# EasyEDA Pro project busmaster-v102.eprj, board main-board
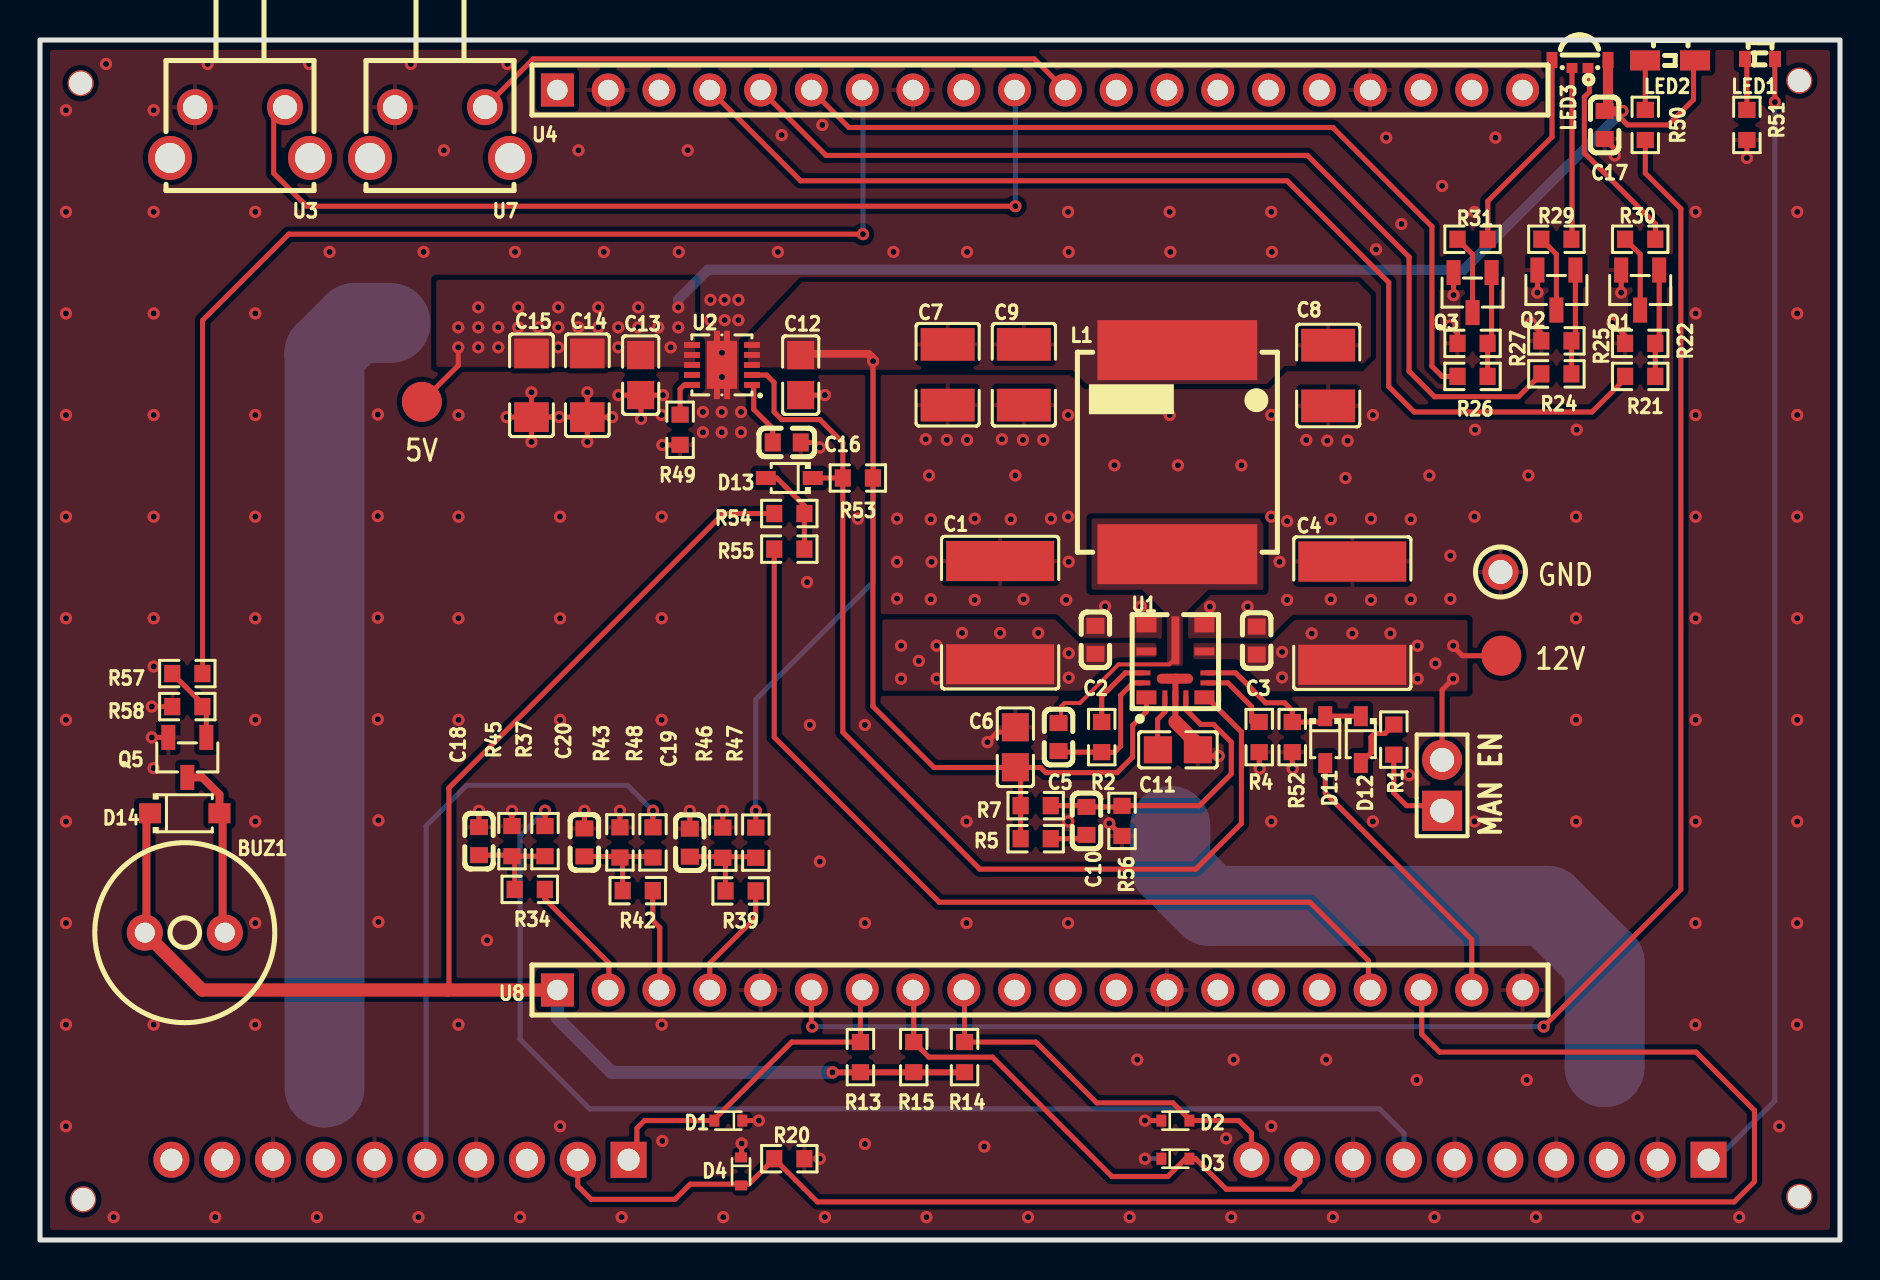
[diagram p7: board, top side]
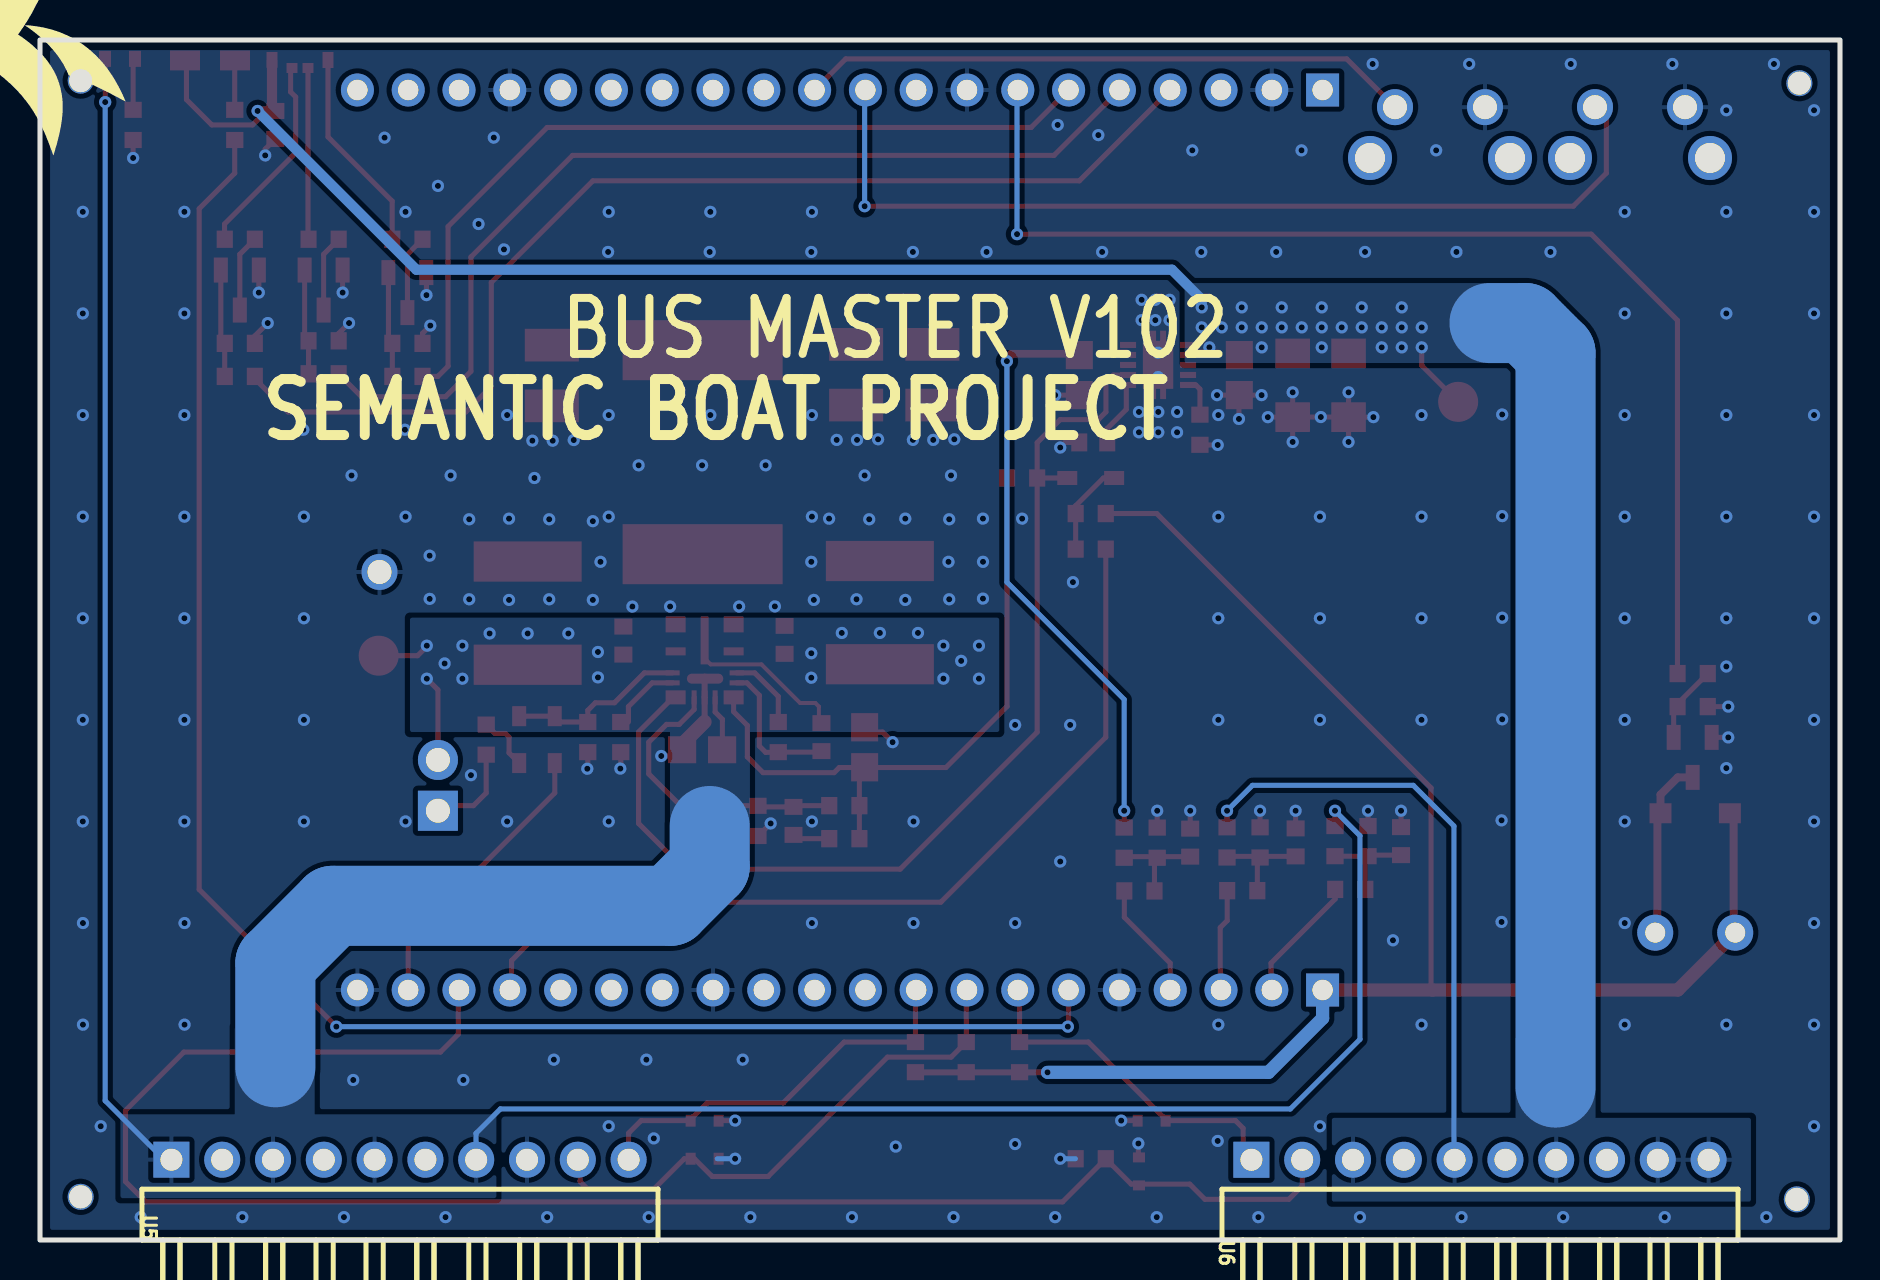
[diagram p8: board, bottom side, seen from below]

Outline 90 x 60 mm; copper layers: Top Layer, Inner1, Inner2, Bottom Layer. Coordinates in mm from the lower left corner of the outline.
Outline path: rectangle 0,60 90,0
Stack: Top Layer 0.035mm Outer layer thickness 1oz / Dielectric1 0.2104mm 7628 RC49% 8.6mil / Inner1 0.0152mm Inner layer thickness / Dielectric2 1.065mm 1.1mm H/HOZ Copper / Inner2 0.0152mm Inner layer thickness / Dielectric3 0.2104mm 7628 RC49% 8.6mil / Bottom Layer 0.035mm Outer layer thickness 1oz

## Design rules (mm)
template: Custom Config
spacing copperThickness1oz (default): track to track 0.102, other pairs 0.152 to 0.3
spacing copperThickness2oz: track to track 0.203, other pairs 0.152 to 0.3
track width copperThickness1oz (default): min 0.127, default 0.254, max 10
track width copperThickness2oz: min 0.203, default 0.254, max 2.54
differential pair differentialPair (default): width min 0.127, default 0.254, max 2.54; gap min 0.152, default 0.152
via viaSize (default): diameter min 0.5, default 0.61, max 10; hole min 0.3, default 0.305, max 6.3

## Placement (name value [footprint] x y rotation side)
BUZ1  2.7kHz  [BUZ-TH_BD9.0-P4.00-D0.6-FD]  7.24 15.37 0 top
C1  22uF  [C2220]  48.01 31.37 270 top
C2  100nF  [C0603]  52.77 30.01 270 top
C3  100nF  [C0603]  60.83 29.97 270 top
C4  22uF  [C2220]  65.62 31.34 270 top
C5  100nF  [C0603]  50.93 25.15 90 top
C6  1uF  [C0805]  48.77 24.64 90 top
C7  47uF  [C1210]  45.38 43.26 90 top
C8  47uF  [C1210]  64.41 43.22 90 top
C9  47uF  [C1210]  49.19 43.26 90 top
C10  22pF  [C0603]  52.32 20.95 90 top
C11  1uF  [C0805]  56.9 24.51 180 top
C12  1uF  [C0805]  38.03 43.24 270 top
C13  1uF  [C0805]  30.03 43.24 270 top
C14  22uF  [C1206]  27.37 42.74 90 top
C15  22uF  [C1206]  24.57 42.74 90 top
C16  3.3nF  [C0603]  37.34 39.88 180 top
C17  100nF  [C0603]  78.23 55.75 270 top
C18  100nF  [C0603]  21.95 19.94 270 top
C19  100nF  [C0603]  32.49 19.87 270 top
C20  100nF  [C0603]  27.22 19.88 270 top
D1  ESD5Z3.3T1G  [SOD-523_L1.2-W0.8-LS1.6-FD]  34.42 5.97 0 top
D2  ESD5Z3.3T1G  [SOD-523_L1.2-W0.8-LS1.6-FD]  56.77 5.97 180 top
D3  ESD5Z3.3T1G  [SOD-523_L1.2-W0.8-LS1.6-FD]  56.77 4.06 180 top
D4  ESD5Z3.3T1G  [SOD-523_L1.2-W0.8-LS1.6-FD]  35.05 3.43 90 top
D11  1N5819WS  [SOD-323_L1.8-W1.3-LS2.5-RD]  64.26 25.02 270 top
D12  1N5819WS  [SOD-323_L1.8-W1.3-LS2.5-RD]  66.04 25.02 270 top
D13  1N5819WS  [SOD-323_L1.8-W1.3-LS2.5-RD]  37.47 38.1 180 top
D14  1N4148W  [SOD-123F_L2.7-W1.6-LS3.8-RD]  7.24 21.34 0 top
H1  PZ254V-11-02P  [HDR-TH_2P-P2.54-V-M]  70.1 22.73 90 top
L1  4.7uH  [IND-SMD_L10.9-W10.0]  56.87 39.39 90 top
LED1  XL-1606UYC  [LED-SMD_L1.7-W1.1-RD_27-21]  86 59.06 0 top
LED2  LTST-S220TGKT  [LED-SMD_L2.2-W0.6-RD_GREEN]  81.5 58.98 0 top
LED3  MHS110RGBCT  [LED-ARRAY-SMD_MHS110RGBCT]  77 58.8 0 top
NOREF  -  [Pad_e59]  87.97 2.16 90 top
NOREF#2  -  [Pad_e58]  2.16 2.03 0 top
NOREF#3  -  [Pad_e61]  2.03 57.84 270 top
NOREF#4  -  [Pad_e60]  87.97 57.97 180 top
Q1  2N7002  [SOT-23-3_L2.9-W1.3-P1.90-LS2.4-BR]  80.01 47.5 90 top
Q2  2N7002  [SOT-23-3_L2.9-W1.3-P1.90-LS2.4-BR]  75.82 47.5 90 top
Q3  2N7002  [SOT-23-3_L2.9-W1.3-P1.90-LS2.4-BR]  71.63 47.37 90 top
Q5  AO3400A  [SOT-23-3_L2.9-W1.3-P1.90-LS2.4-BR]  7.37 24.13 90 top
R1  10kΩ  [R0603]  67.69 25.02 90 top
R2  0Ω  [R0603]  53.09 25.15 90 top
R4  33kΩ  [R0603]  60.96 25.15 90 top
R5  1kΩ  [R0603]  49.78 20.07 180 top
R7  100kΩ  [R0603]  49.78 21.72 180 top
R13  2.2kΩ  [R0603]  41.02 9.14 270 top
R14  2.2kΩ  [R0603]  46.23 9.14 270 top
R15  2.2kΩ  [R0603]  43.69 9.14 270 top
R20  47kΩ  [R0603]  37.47 4.06 180 top
R21  100Ω  [R0603]  80.01 43.18 180 top
R22  100kΩ  [R0603]  80.01 44.83 180 top
R24  100Ω  [R0603]  75.82 43.31 0 top
R25  100kΩ  [R0603]  75.82 44.96 180 top
R26  100Ω  [R0603]  71.63 43.18 0 top
R27  100kΩ  [R0603]  71.63 44.83 180 top
R29  100Ω  [R0603]  75.82 50.04 0 top
R30  100Ω  [R0603]  80.01 50.04 0 top
R31  120Ω  [R0603]  71.63 50.04 0 top
R34  1kΩ  [R0603]  24.49 17.53 0 top
R37  100kΩ  [R0603]  25.25 19.94 270 top
R39  1kΩ  [R0603]  35.03 17.45 0 top
R42  1kΩ  [R0603]  29.89 17.47 0 top
R43  47kΩ  [R0603]  29 19.88 270 top
R45  10kΩ  [R0603]  23.6 19.94 270 top
R46  47kΩ  [R0603]  34.14 19.87 270 top
R47  100kΩ  [R0603]  35.79 19.87 270 top
R48  100kΩ  [R0603]  30.65 19.88 270 top
R49  30kΩ  [R0603]  32 40.51 90 top
R50  4.7kΩ  [R0603]  80.26 55.75 90 top
R51  15kΩ  [R0603]  85.34 55.75 90 top
R52  100kΩ  [R0603]  62.61 25.15 90 top
R53  100kΩ  [R0603]  40.89 38.1 0 top
R54  47kΩ  [R0603]  37.47 36.32 180 top
R55  4.7kΩ  [R0603]  37.47 34.54 180 top
R56  24kΩ  [R0603]  54.1 20.95 90 top
R57  220Ω  [R0603]  7.37 28.32 180 top
R58  47kΩ  [R0603]  7.37 26.67 0 top
TP8  RH-5004  [TESTPOINT_TH_BD2.5-D1.2]  73.03 33.4 0 top
TP38  -  [Test-Point-0.5mm]  73.07 29.22 0 top
TP39  -  [Test-Point-0.5mm]  19.09 41.91 0 top
U1  LM61460AANRJRR  [VQFN-HR-14_L4.0-W3.5-P0.50-TL_TI_RJR-1]  56.77 28.96 90 top
U2  TCKE812NA,RF  [VSON-10_L3.0-W3.0-P0.50-TL-EP]  34.1 43.75 180 top
U3  TC-6615-9.0-160G  [KEY-TH_PTS645VXX83XLFS]  10 55.37 180 top
U4  KH-2.54FH-1X20P-H8.5  [HDR-TH_20P-P2.54-V-F-2]  50 57.5 0 top
U5  2541WR-10P  [HDR-TH_10P-P2.54-H-M-W10.4]  72 4.01 180 bottom
U6  2541WR-10P  [HDR-TH_10P-P2.54-H-M-W10.4]  18 4.01 180 bottom
U7  TC-6615-9.0-160G  [KEY-TH_PTS645VXX83XLFS]  20 55.37 180 top
U8  KH-2.54FH-1X20P-H8.5  [HDR-TH_20P-P2.54-V-F-2]  50 12.5 0 top

## Footprints (pads in the part's own frame, mm; a bottom-side part is the same pattern mirrored in y, then rotated)
BUZ-TH_BD9.0-P4.00-D0.6-FD
  round 1.8 hole 1: 1(-2,0) 2(2,0)
C0603
  rect 0.8x0.9 smd: 1(-0.7,0) 2(0.7,0)
C0805
  rect 1.41x1.35 smd: 1(-1,0) 2(1,0)
C1206
  rect 1.485x1.728 smd: 1(-1.593,0) 2(1.593,0)
C1210
  rect 1.635x2.7 smd: 1(-1.518,0) 2(1.518,0)
C2220
  rect 2.01x5.4 smd: 1(-2.58,0) 2(2.58,0)
HDR-TH_2P-P2.54-V-M
  rect 2x2 hole 1.2: 1(-1.27,0)
  round 2 hole 1.2: 2(1.27,0)
HDR-TH_10P-P2.54-H-M-W10.4
  rect 1.8x1.8 hole 1.1: 1(-11.43,0)
  round 1.8 hole 1.1: 2(-8.89,0) 3(-6.35,0) 4(-3.81,0) 5(-1.27,0) 6(1.27,0) 7(3.81,0) 8(6.35,0) 9(8.89,0) 10(11.43,0)
HDR-TH_20P-P2.54-V-F-2
  rect 1.65x1.65 hole 1.02: 1(-24.13,0)
  round 1.65 hole 1.02: 2(-21.59,0) 3(-19.05,0) 4(-16.51,0) 5(-13.97,0) 6(-11.43,0) 7(-8.89,0) 8(-6.35,0) 9(-3.81,0) 10(-1.27,0) 11(1.27,0) 12(3.81,0) 13(6.35,0) 14(8.89,0) 15(11.43,0) 16(13.97,0) 17(16.51,0) 18(19.05,0) 19(21.59,0) 20(24.13,0)
IND-SMD_L10.9-W10.0
  rect 3x8 smd: 1(-5.1,0) 2(5.1,0)
KEY-TH_PTS645VXX83XLFS
  round 1.8 hole 1.2: 1(-2.25,-1.27) 2(2.25,-1.27)
  round 2.2 hole 1.5: 3(-3.5,1.27) 4(3.5,1.27)
LED-ARRAY-SMD_MHS110RGBCT
  rect 0.55x0.5 smd: 1(0.4,-0.2) 4(-0.4,-0.2)
  rect 0.55x0.8 smd: 2(1.4,0.2) 3(-1.4,0.2)
LED-SMD_L1.7-W1.1-RD_27-21
  rect 0.6x0.8 smd: 1(-0.75,0) 2(0.75,0)
LED-SMD_L2.2-W0.6-RD_GREEN
  rect 1.5x1 smd: 1(-1.25,0) 2(1.25,0)
Pad_e58
  round 1.3 hole 1.152: 1(0,0)
Pad_e59
  round 1.3 hole 1.152: 1(0,0)
Pad_e60
  round 1.3 hole 1.152: 1(0,0)
Pad_e61
  round 1.3 hole 1.152: 1(0,0)
R0603
  rect 0.806x0.864 smd: 1(-0.753,0) 2(0.753,0)
SOD-123F_L2.7-W1.6-LS3.8-RD
  rect 1.1x1 smd: 1(-1.735,0) 2(1.735,0)
SOD-323_L1.8-W1.3-LS2.5-RD
  rect 1x0.7 smd: 1(-1.173,0) 2(1.173,0)
SOD-523_L1.2-W0.8-LS1.6-FD
  rect 0.5x0.6 smd: 1(-0.7,0) 2(0.7,0)
SOT-23-3_L2.9-W1.3-P1.90-LS2.4-BR
  rect 1.25x0.7 smd: 1(1,-0.95) 2(1,0.95) 3(-1,0)
Test-Point-0.5mm
  round 2 smd: 1(0,0)
TESTPOINT_TH_BD2.5-D1.2
  round 1.8 hole 1.2: 1(0,0)
VQFN-HR-14_L4.0-W3.5-P0.50-TL_TI_RJR-1
  rect 0.7x1 smd: 1(-1.825,1.45) 5(-1.825,-1.45)
  rect 0.7x0.25 smd: 2(-1.825,0.525) 4(-1.825,-0.525)
  rect 0.7x0.3 smd: 3(-1.825,0)
  rect 0.25x0.7 smd: 6(-1.1,-1.6) 7(-0.6,-1.6) 13(-0.6,1.6) 14(-1.1,1.6)
  rect 0.4x1 smd: 8(0.475,-1.45) 12(0.475,1.45)
  rect 0.8x1 smd: 9(1.825,-1.45) 11(1.825,1.45)
  rect 2.4x0.4 smd: 10(1.025,0)
VSON-10_L3.0-W3.0-P0.50-TL-EP
  rect 0.8x0.3 smd: 1(-1.5,1) 2(-1.5,0.5) 3(-1.5,0) 4(-1.5,-0.5) 5(-1.5,-1) 6(1.5,-1) 7(1.5,-0.5) 8(1.5,0) 9(1.5,0.5) 10(1.5,1)
  custom 1.52x3.42 smd: 11(0.002,-0.009)

## Nets
As in the schematic.

Pads without a net: NOREF 1; NOREF#2 1; NOREF#3 1; NOREF#4 1; U2 9; U3 3 4; U4 1 3 9 12 13 14 15 16 18 19 20; U7 3 4; U8 10 11 12 14 15 16

## Via types
v1: diameter 0.61, hole 0.305, Top Layer to Bottom Layer, 306 vias

## Routing (per net, layer and track width the routed paths; a pad name or vN(x,y) marks a point on that pad's centre or on a via; arc(x,y) is an arc through that point)
5V0_GOOD: length 53.7
  Top Layer w0.254: 35.58,43.23 35.6,43.25 36.33,43.25 36.7,42.88 36.7,41.4 37.08,41.02 38.99,41.02 40.14,39.87 R53.1 ; U1.5 58.34,27.13 60.07,25.4 60.07,20.83 57.78,18.54 46.99,18.54 40.14,25.39 R53.1 ; R53.1 D13.1
5V_UNFUSED: length 72.5
  Top Layer w0.254: 41.65,43.95 R53.2 41.65,26.68 44.7,23.62 48.75,23.62 C6.1 48.78,23.62 ; 41.65,43.95 41.35,44.24 C12.1 38.17,44.38 41.47,44.38 41.65,44.2 41.65,43.95 ; 41.65,43.95 v1(41.66,43.94) ; U1.1 55.32,26.42 54.63,25.73 54.63,24.15 53.85,23.37 50.29,23.37 50.04,23.62 48.78,23.62 ; 48.78,23.62 49.03,23.38 R7.2 R5.2 ; R47.1 v1(35.79,21.46)
  Bottom Layer w0.254: v1(35.79,21.46) 35.79,27.03 41.66,32.89 41.66,44.07
+3V3: length 83
  Top Layer w0.254: 5.5,15.63 BUZ1.1 ; R54.2 34.16,36.32 20.45,22.61 20.45,12.57 20.37,12.5
  Top Layer w0.305: R14.2 46.22,8.38 v1(39.62,8.38)
  Top Layer w0.4: 5.5,15.63 5.32,15.82 5.32,21.15 D14.1
  Top Layer w0.66: BUZ1.1 8.11,12.5 U8.1
  Bottom Layer w0.66: v1(39.62,8.38) 28.57,8.38 25.87,11.09 U8.1
+5V: length 136.2
  Top Layer w0.254: 30.65,20.63 v1(30.65,21.46) ; 78.68,56.45 79.38,55.75 81.41,55.75 82.68,57.02 82.68,58.91 LED2.2 ; TP39.1 20.91,43.73 v1(20.91,44.63)
  Top Layer w0.457: C17.1 v1(79.12,56.45)
  Top Layer w0.508: C17.1 78.4,56.62 LED3.2
  Bottom Layer w0.254: U6.5 19.3,4.05 19.3,20.7 21.34,22.73 29.38,22.73 v1(30.65,21.46)
  Bottom Layer w0.508: v1(31.91,46.63) 31.91,47.03 33.4,48.51 71.18,48.51 v1(79.12,56.45)
  Bottom Layer w4: 14.22,7.62 14.22,44.34 15.73,45.85 17.53,45.85
  vias: v1(20.91,45.63) v1(21.91,46.63) v1(21.91,45.63) v1(21.91,44.63) v1(22.91,45.63) v1(22.91,44.63) v1(23.91,46.63) v1(23.91,45.63) v1(24.91,45.63) v1(25.91,46.63) v1(25.91,45.63) v1(25.91,44.63) v1(26.91,45.63) v1(27.91,46.63) v1(27.91,45.63) v1(28.91,45.63) v1(28.91,44.63) v1(29.91,46.63) v1(29.91,45.63) v1(30.91,45.63) v1(31.53,44.63) v1(31.91,45.63)
+12V: length 154.4
  Top Layer w0.254: v1(70.66,29.72) 70.66,29.68 71.12,29.22 TP38.1 ; LED1.2 86.74,59.05 v1(86.74,56.9) ; v1(70.66,28.06) 70.1,27.51 70.1,24.26 ; R37.1 v1(25.25,21.46)
  Bottom Layer w0.254: v1(25.25,21.46) 24,20.22 24,10.03 27.48,6.55 66.98,6.55 68.2,5.33 68.2,4.02 U5.7 ; U5.1 83.79,4.01 86.74,6.97 v1(86.74,56.9)
  Bottom Layer w4: 78.23,8.64 78.23,13.84 75.37,16.71 58.48,16.71 56.51,18.67 56.51,20.7
  vias: v1(43.05,29.72) v1(43.05,28.07) v1(43.94,28.96) v1(44.83,29.72) v1(44.83,28.07) v1(46.1,30.35) v1(48.01,30.35) v1(49.91,30.35) v1(51.44,29.34) v1(51.44,28.11) v1(62.1,29.4) v1(62.1,28.13) v1(63.58,30.33) v1(65.62,30.33) v1(67.52,30.33) v1(68.88,29.72) v1(68.88,28.06) v1(69.77,28.83)
GND: length 47.4
  Top Layer w0.254: C20.1 v1(27.22,21.46) ; C19.1 v1(32.49,21.46) ; v1(70.49,45.72) 70.87,45.33 R27.2 ; Q2.2 v1(74.87,47.37) ; 35.08,4.06 v1(35.08,4.83) ; v1(28.92,42.24) C13.2 ; 29,20.63 v1(29,21.46) ; Q5.2 v1(5.59,25.13) ; v1(74.55,45.85) 75.07,45.33 R25.2 ; Q3.2 v1(70.68,47.24) ; v1(24.57,42.38) C15.1 ; C15.1 v1(23.33,41.14) ; C15.1 24.58,41.15 v1(25.96,41.15) 27.36,41.15 C14.1 ; C15.1 v1(24.57,39.9) ; v1(27.37,39.9) C14.1 ; C14.1 v1(27.37,42.38) ; C14.1 v1(28.61,41.14) ; v1(62.63,23.56) 62.61,23.59 R52.1 ; v1(47.37,24.89) 47.88,25.4 48.53,25.4 C6.2 ; R49.1 32,39.75 v1(31.12,39.75) ; 56.1,5.97 v1(55.25,5.97) ; v1(31.15,42.24) 30.04,42.24 30.05,42.23 v1(30.05,41.05) ; v1(78.74,54.23) 78.74,54.55 C17.2 ; R51.1 v1(85.34,54.1) ; C18.1 v1(21.95,21.46) ; v1(78.61,45.85) 79.26,45.2 R22.2 ; R45.1 v1(23.6,21.46) ; Q1.2 v1(79.06,47.37) ; C12.2 v1(39.24,42.24) ; v1(60.98,23.57) 60.96,23.59 R4.1 ; R56.1 54.09,20.2 v1(53.47,20.83) ; R46.1 v1(34.14,21.46) ; v1(58.94,24.2) 58.21,24.2 C11.1 ; C16.1 38.74,39.88 v1(38.99,39.62) ; 35.08,5.97 v1(35.94,5.97) ; R58.1 v1(5.59,26.67)
  Top Layer w0.3: 56.77,25.91 U1.3 56.77,28.06 56.76,28.07
  Top Layer w0.5: 57.4,28.07 56.09,28.07
  Top Layer w0.7: C11.1 57.9,24.78 56.77,25.91
  Bottom Layer w0.254: 56.13,4.06 v1(55.25,4.06) ; 38.23,4.06 v1(38.99,4.06)
  vias: v1(1.3,56.49) v1(1.3,51.41) v1(1.3,46.33) v1(1.3,41.25) v1(1.3,36.17) v1(1.3,31.09) v1(1.3,26.01) v1(1.3,20.93) v1(1.3,15.85) v1(1.3,10.77) v1(1.3,5.69) v1(3.3,58.8) v1(3.68,1.14) v1(5.68,56.49) v1(5.68,51.41) v1(5.68,46.33) v1(5.68,41.25) v1(5.68,36.17) v1(5.68,31.09) v1(5.68,28.67) v1(5.68,23.59) v1(5.68,10.77) v1(8.38,58.8) v1(8.76,1.14) v1(10.76,51.41) v1(10.76,46.33) v1(10.76,41.25) v1(10.76,36.17) v1(10.76,31.09) v1(10.76,26.01) v1(10.76,20.93) v1(10.76,15.85) v1(10.76,10.77) v1(13.46,58.8) v1(13.84,1.14) v1(14.48,49.4) v1(16.89,41.28) v1(16.89,36.19) v1(16.89,31.11) v1(16.89,26.03) v1(16.92,20.98) v1(16.92,15.9) v1(18.54,58.8) v1(18.92,1.14) v1(19.18,49.4) v1(20.19,54.48) v1(20.92,41.25) v1(20.92,36.17) v1(20.92,31.09) v1(20.92,26.01) v1(20.92,10.77) v1(22.35,14.99) v1(23.37,58.8) v1(23.75,49.4) v1(24,1.14) v1(26,36.17) v1(26,31.09) v1(26,26.01) v1(26,5.69) v1(26.92,54.48) v1(28.19,49.4) v1(29.08,1.14) v1(31.08,41.25) v1(31.08,36.17) v1(31.08,31.09) v1(31.08,26.01) v1(31.08,10.77) v1(31.12,4.95) v1(31.94,49.4) v1(32.38,54.48) v1(33.15,41.4) v1(33.15,40.39) v1(33.52,47.01) v1(33.52,45.99) v1(34.1,44.36) v1(34.1,43.15) v1(34.09,41.4) v1(34.09,40.39) v1(34.23,47.01) v1(34.23,45.99) v1(34.16,1.14) v1(34.92,47.01) v1(34.92,45.99) v1(35.05,41.4) v1(35.05,40.39) v1(36.89,49.4) v1(37.08,55.25) v1(38.35,32.89) v1(38.49,25.75) v1(38.99,18.92) v1(39.12,55.75) v1(39.24,1.14) v1(40.89,36.07) v1(41.24,25.75) v1(41.24,15.85) v1(41.24,4.8) v1(42.67,49.4) v1(42.85,33.91) v1(42.85,36.07) v1(42.85,32.07) v1(44.29,40.04) v1(44.32,1.14) v1(44.45,38.23) v1(44.54,36.04) v1(44.54,32.04) v1(44.58,33.91) v1(45.34,40) v1(46.32,20.93) v1(46.32,15.85) v1(46.35,49.4) v1(46.35,40) v1(46.74,36.07) v1(46.74,32) v1(47.21,4.67) v1(48.1,40.04) v1(48.54,36.04) v1(48.77,38.23) v1(49.15,40) v1(49.18,32.04) v1(49.4,1.14) v1(50.16,40) v1(50.55,36.07) v1(51.31,32) v1(51.4,51.41) v1(51.44,49.4) v1(51.4,41.25) v1(51.4,36.17) v1(51.44,33.91) v1(51.4,20.93) v1(51.4,15.85) v1(53.26,31.68) v1(53.72,38.73) v1(54.48,1.14) v1(54.86,9.02) v1(55.04,31.67) v1(56.48,51.41) v1(56.51,49.4) v1(56.48,41.25) v1(56.9,38.73) v1(58.5,31.67) v1(59.31,5.08) v1(59.56,1.14) v1(59.68,9.02) v1(60.07,38.73) v1(60.38,31.67) v1(61.56,51.41) v1(61.59,49.4) v1(61.56,41.25) v1(61.56,36.17) v1(61.56,20.93) v1(61.56,5.69) v1(61.98,33.91) v1(62.36,35.94) v1(62.36,32) v1(63.31,40) v1(64.31,9.02) v1(64.37,39.97) v1(64.54,36.04) v1(64.54,32.04) v1(64.64,1.14) v1(65.28,38.1) v1(65.38,39.97) v1(66.55,36.07) v1(66.55,32) v1(66.64,41.25) v1(66.64,20.93) v1(66.8,49.53) v1(67.31,55.12) v1(68.07,50.8) v1(68.54,36.04) v1(68.54,32.04) v1(68.45,23.24) v1(68.83,8) v1(69.47,38.23) v1(69.72,1.14) v1(70.1,52.7) v1(70.52,34.22) v1(70.52,32.06) v1(71.72,51.41) v1(71.72,36.17) v1(71.72,20.93) v1(71.75,40.51) v1(72.77,55.12) v1(74.34,8) v1(74.42,38.23) v1(74.8,1.14) v1(76.84,40.51) v1(76.8,36.17) v1(76.8,31.09) v1(76.8,26.01) v1(76.8,20.93) v1(79.88,1.14) v1(82.78,51.41) v1(82.78,46.33) v1(82.78,41.25) v1(82.78,36.17) v1(82.78,31.09) v1(82.78,26.01) v1(82.78,20.93) v1(82.77,15.85) v1(82.77,10.77) v1(84.96,1.14) v1(86.96,5.69) v1(87.86,51.41) v1(87.86,46.33) v1(87.86,41.25) v1(87.86,36.17) v1(87.86,31.09) v1(87.86,26.01) v1(87.86,20.93) v1(87.85,15.85) v1(87.85,10.77)
BTN_FUN_0: length 47.1
  Top Layer w0.254: v1(48.77,51.69) 13.33,51.69 11.68,53.34 11.68,56.08 U3.1
  Bottom Layer w0.254: v1(48.77,51.69) 48.77,57.46 U4.10
BTN_FUN_1: length 30.7
  Top Layer w0.254: U7.1 24.66,59.06 49.72,59.06 U4.11
GPIO_PA0_T21: length 59.7
  Top Layer w0.254: v1(41.15,50.29) 12.44,50.29 8.13,45.98 8.13,28.33 R57.1
  Bottom Layer w0.254: v1(41.15,50.29) 41.15,57.46 U4.7
GPIO_PA4_D_CS: length 6.4
  Top Layer w0.254: R34.2 25.24,17.05 28.45,13.84 28.45,12.54 U8.2
GPIO_PA5_D_SCK: length 5.9
  Top Layer w0.254: R39.2 35.78,16.14 33.49,13.84 U8.4
GPIO_PA6_D_DC: length 5.1
  Top Layer w0.254: U8.3 30.99,12.54 30.99,15.62 30.64,15.97 R42.2
GPIO_PA7_D_MOSI: length 86.3
  Top Layer w0.254: v1(38.61,10.67) 38.57,10.71 U8.6 ; R50.1 80.26,53.34 82.04,51.56 82.04,17.53 v1(75.18,10.67)
  Bottom Layer w0.254: v1(38.61,10.67) v1(75.18,10.67)
GPIO_PA8_T11: length 56.3
  Top Layer w0.254: U4.4 38.03,52.96 62.36,52.96 67.44,47.88 67.44,42.67 68.71,41.4 77.6,41.4 79.26,43.06 R21.2
GPIO_PA9_T12: length 49.2
  Top Layer w0.254: R24.1 73.92,42.16 69.72,42.16 68.45,43.43 68.45,49.15 63.37,54.23 39.3,54.23 U4.5
GPIO_PA10_T13: length 42.3
  Top Layer w0.254: U4.6 40.44,55.63 64.64,55.63 69.6,50.67 69.6,43.69 70.1,43.18 R26.1
GPIO_PB5_FP: length 14.4
  Top Layer w0.254: U8.19 71.59,15.02 64.26,22.35 D11.2
GPIO_PB10_F4: length 45.2
  Top Layer w0.254: R55.2 36.71,25.14 44.96,16.89 63.5,16.89 66.42,13.97 66.42,12.59 U8.17
GPIO_PB11_F5: length 86.6
  Top Layer w0.254: U8.18 69.09,12.46 69.09,10.29 69.98,9.4 82.8,9.4 85.72,6.48 85.72,2.92 84.71,1.91 38.87,1.91 R20.2 35.44,2.79 32.51,2.79 31.75,2.03 27.56,2.03 26.89,2.7 U6.2
GPIO_PB12_D_BUSY: length 17.3
  Top Layer w0.254: U6.1 29.84,4.43 29.84,5.59 30.23,5.97 33.66,5.97 37.58,9.9 R13.1 41.02,12.41 U8.7
GPIO_PB13_D_PWR: length 27
  Top Layer w0.254: U8.8 43.69,12.46 R15.1 44.44,9.14 47.62,9.14 53.59,3.18 56.39,3.18 57.28,4.06 57.78,4.06 59.31,2.54 62.61,2.54 62.99,2.92 62.99,3.9 U5.9
GPIO_PB14_D_RST: length 20.2
  Top Layer w0.254: U5.10 60.57,5.34 59.94,5.97 57.53,5.97 56.64,6.86 52.83,6.86 49.79,9.9 R14.1 46.23,12.46 U8.9
$1N1788: length 3.5
  Top Layer w0.254: 60.58,25.9 60.58,26.67 59.39,27.86 U1.6
$1N1790: length 2.8
  Top Layer w0.254: C11.2 55.88,24.53 55.88,26.03 56.24,26.4 U1.2
$1N1799: length 7.2
  Top Layer w0.254: U1.14 54.65,27.86 54.03,27.24 54.03,24.7 53.72,24.38 53.09,24.38 R2.1 50.98,24.39 C5.1
$1N1800: length 8.5
  Top Layer w0.2: C5.2 51.05,25.97 51.05,26.67 51.23,26.85 52,26.85 53.93,28.78 56.47,28.78 56.77,29.08 56.77,29.98
$1N1801: length 3.8
  Top Layer w0.254: R2.2 53.09,27.18 54.26,28.36 U1.13
$1N1803: length 1.9
  Top Layer w0.254: R5.1 52.13,20.07 C10.1
$1N1828: length 3.3
  Top Layer w0.254: C16.2 36.64,40.58 35.69,41.53 35.69,42.66 U2.1
$1N1840: length 2
  Top Layer w0.254: U2.10 32.21,42.75 32,42.55 R49.2
$1N2839: length 4.6
  Top Layer w0.254: 70.1,21.72 68.33,21.72 67.69,22.35 R1.1
$1N10605: length 10.3
  Top Layer w0.254: R31.2 72.39,50.05 72.39,51.94 75.6,55.15 LED3.3
$1N10606: length 8.6
  Top Layer w0.254: R29.2 76.6,50.07 LED3.4
$1N10607: length 10.2
  Top Layer w0.254: LED3.1 77.47,58.53 77.47,57.4 77.22,57.15 77.22,54.36 80.77,50.8 80.77,50.05 R30.2
$1N10610: length 5.4
  Top Layer w0.254: Q1.1 80.96,45.03 R22.1 R21.1
$1N10615: length 5.3
  Top Layer w0.254: R24.2 R25.1 76.77,45.15 Q2.1
$1N10618: length 5.3
  Top Layer w0.254: R26.2 R27.1 72.58,45.03 Q3.1
$1N10624: length 3.9
  Top Layer w0.254: R30.1 80.01,49.28 Q1.3
$1N10625: length 3.9
  Top Layer w0.254: R29.1 75.82,49.28 Q2.3
$1N10626: length 4
  Top Layer w0.254: Q3.3 71.63,49.28 R31.1
$1N11416: length 9.1
  Top Layer w0.254: 8.97,15.63 BUZ1.2
  Top Layer w0.4: Q5.3 8.11,23.13 8.97,22.27 D14.2 9.13,21.18 9.13,15.79 8.97,15.63
$1N11420: length 3.9
  Top Layer w0.254: R57.2 8.12,26.81 R58.2 8.32,26.47 Q5.1
$1N12137: length 5
  Top Layer w0.254: C18.2 23.55,19.24 R45.2 ; R45.2 23.73,19.05 R34.1 ; R45.2 R37.2
$1N12370: length 5
  Top Layer w0.254: R47.2 35.74,19.17 C19.2 ; R46.2 34.28,18.98 R39.1
$1N12940: length 5.2
  Top Layer w0.254: R43.2 29.13,18.99 R42.1 ; C20.2 30.59,19.18 R48.2
$1N13806: length 2.5
  Top Layer w0.254: LED2.1 80.26,58.96 R50.2
$1N13885: length 2.6
  Top Layer w0.254: LED1.1 85.34,58.96 R51.2
$1N14651: length 8.8
  Top Layer w0.254: 62.61,26.29 62.61,26.48 62.23,26.86 61.28,26.86 59.78,28.36 U1.7 ; D12.1 D11.1 63.97,25.9 R52.2
$1N14703: length 2.9
  Top Layer w0.254: D12.2 66.55,24.35 66.55,25.15 66.73,25.33 67.24,25.33 R1.2
$1N15114: length 4.7
  Top Layer w0.254: D13.2 36.83,38.1 38.22,36.71 R54.1 R55.1
$1N15275: length 14.9
  Top Layer w0.254: R7.1 52.26,21.72 C10.2 54.05,21.66 R56.2 54.11,21.72 57.98,21.72 59.56,23.3 59.56,24.89 58.67,25.78 58.04,25.78 57.29,26.53 U1.4

## Copper pours and planes (outline as drawn; the poured copper is in the pictures)
5V_UNFUSED on Top Layer: 35.4,45.02 35.4,43.62 37.13,43.63 37.25,43.52 51.62,43.5 52.32,42.8 61.34,42.8 62.23,43.69 66.04,43.69 66.55,44.2 66.55,47.24 65.9,47.89 38.11,47.89
+5V on Top Layer: 19.81,48.01 32.76,48.01 32.76,43.66 19.81,43.66
+5V on Bottom Layer: 32.77,43.85 16.51,43.85 16.51,47.85 32.77,47.85
+5V on Bottom Layer: 4.45,6.11 25.41,6.11 25.41,1.92 4.45,1.92
+5V on Bottom Layer: 12.22,5.33 12.22,10.16 16.22,10.16 16.22,5.33
+12V on Top Layer: 51.94,29.85 55.73,29.85 55.82,29.84 55.83,29.07 55.82,29.06 53.62,29.06 52.02,27.47 42.11,27.47 42.12,31.03 50.76,31.03
+12V on Top Layer: 61.54,29.82 57.73,29.85 57.66,29.84 57.66,29.04 59.86,29.04 61.47,27.43 71.37,27.43 71.37,31 62.72,31
+12V on Bottom Layer: 76.26,5.84 76.26,10.67 80.26,10.67 80.26,5.84
+12V on Bottom Layer: 67.18,6.29 85.98,6.29 85.98,2.1 67.18,2.1
+12V on Bottom Layer: 54.5,20.07 54.5,26.8 58.5,26.8 58.5,20.07
+12V on Bottom Layer: 42.04,31.11 71.5,31.11 71.5,25.4 42.04,25.4
GND on Top Layer: -2.41,62.1 91.69,62.1 91.69,-1.52 -2.41,-1.52
GND on Bottom Layer: -2.79,62.61 89.66,62.61 89.66,-1.65 -2.79,-1.65
GND on Inner1: -2.54,61.85 92.07,61.85 92.07,-1.4 -2.54,-1.4
GND on Inner2: -2.54,62.61 91.95,62.61 91.95,-2.29 -2.54,-2.29
$1N1800 on Top Layer: 57.14,28.6 57.14,31.24 58.42,32.51 61.17,32.51 61.17,36.08 52.58,36.08 52.58,32.51 55.11,32.51 56.35,31.27 56.35,28.6

## Text on the board
Bottom Silkscreen Layer: BUS MASTER V102 | SEMANTIC BOAT PROJECT
Top Silkscreen Layer: 5V | 12V | GND | MAN EN
